# EAGLE schematic Logic level converter (EAGLE 7.6.0)
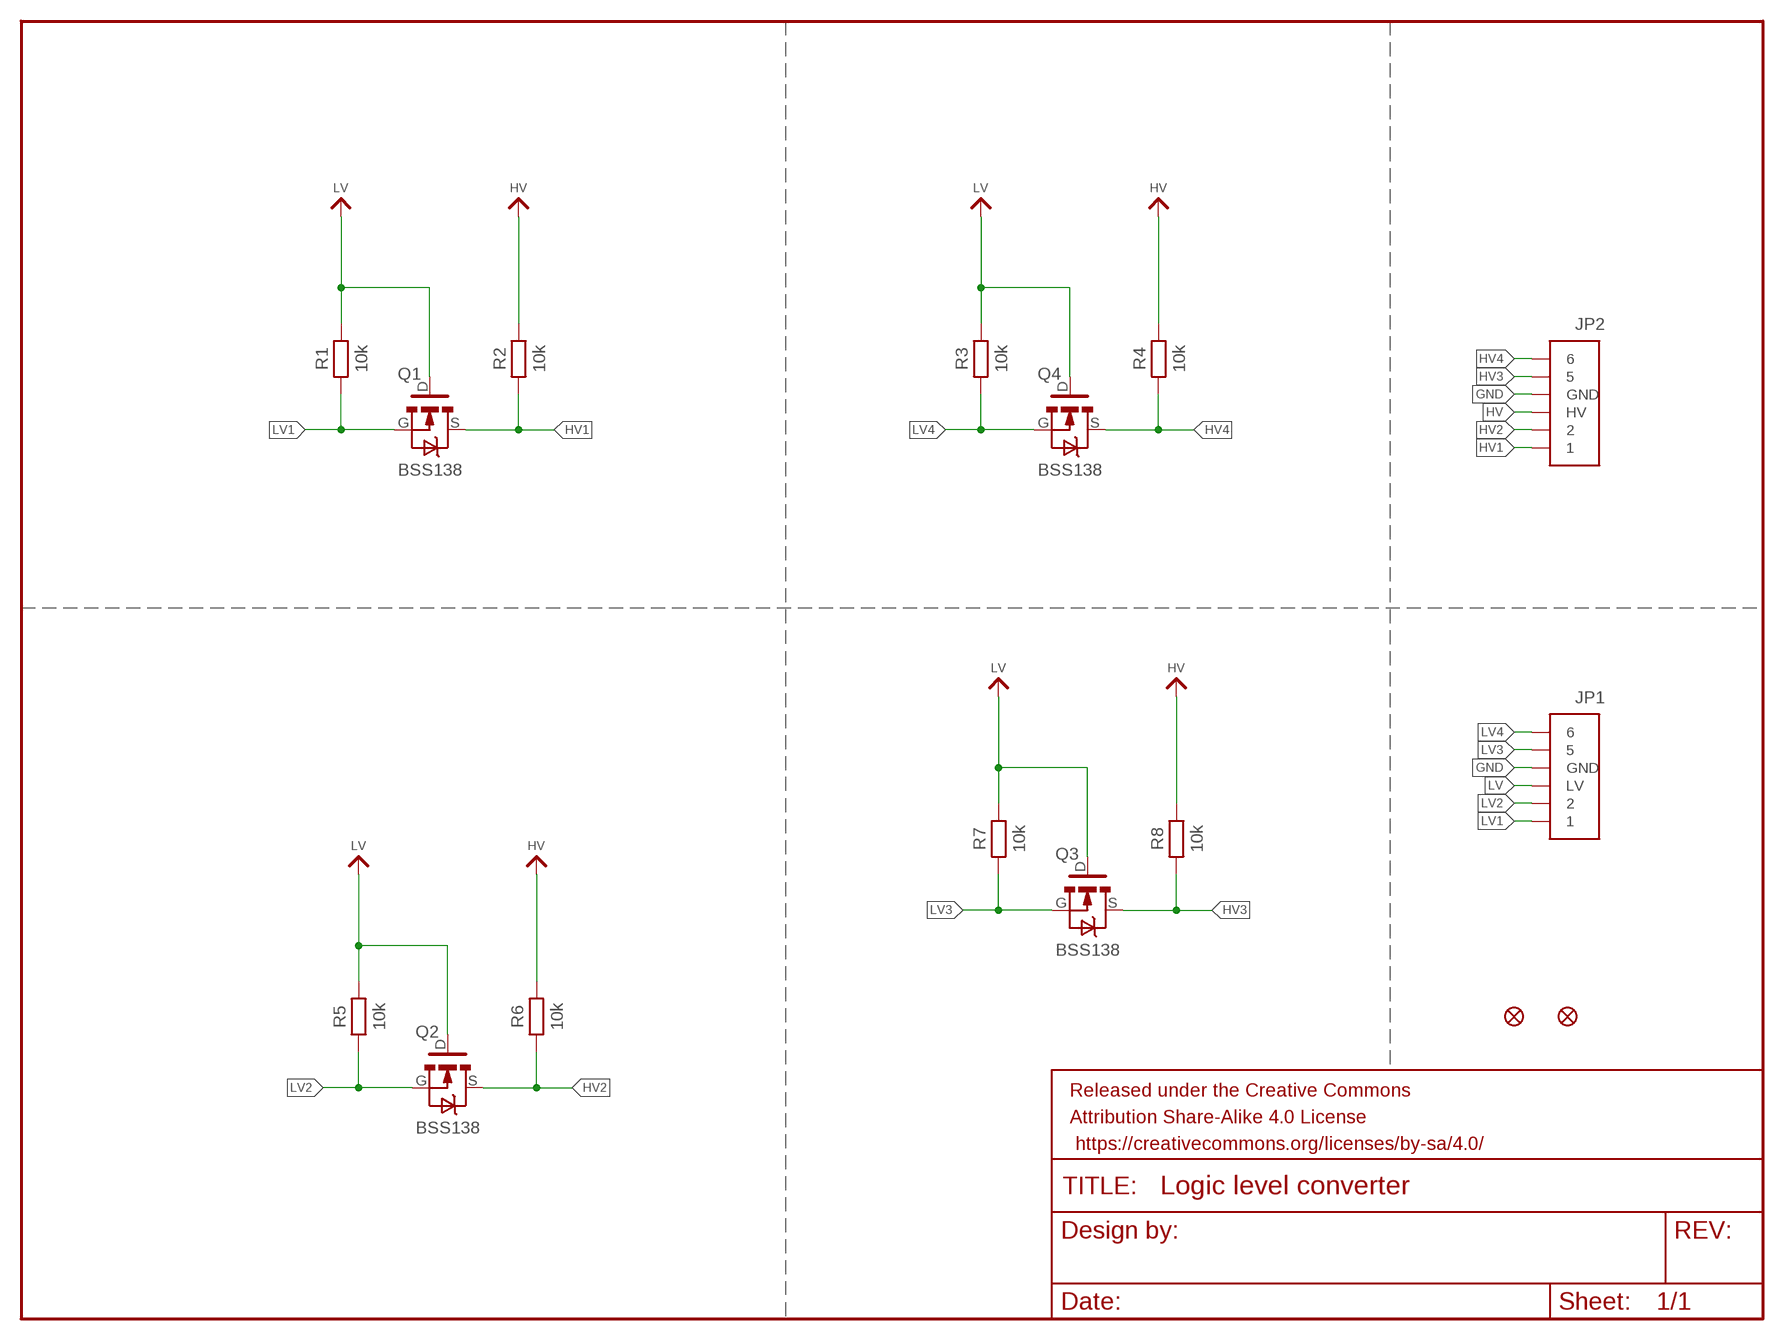
[diagram p0: schematic, sheet 1]

## Parts
FD1  FIDUCIAL1X2  [FIDUCIAL-1X2]
FD2  FIDUCIALUFIDUCIAL  [FIDUCIAL-MICRO]
FRAME1  FRAME-LETTERNO_PACKAGE  [DUMMY]
JP1  JUMPER_6PIN_LLC_LV  [JUMPER_6PIN_LLC_LV]
JP2  JUMPER_6PIN_LLC_HV  [JUMPER_6PIN_LLC_HV]
Q1  BSS138  [SOT-23]
Q2  BSS138  [SOT-23]
Q3  BSS138  [SOT-23]
Q4  BSS138  [SOT-23]
R1  10k  0603_RESISTOR  [0603_RESISTOR]
R2  10k  0603_RESISTOR  [0603_RESISTOR]
R3  10k  0603_RESISTOR  [0603_RESISTOR]
R4  10k  0603_RESISTOR  [0603_RESISTOR]
R5  10k  0603_RESISTOR  [0603_RESISTOR]
R6  10k  0603_RESISTOR  [0603_RESISTOR]
R7  10k  0603_RESISTOR  [0603_RESISTOR]
R8  10k  0603_RESISTOR  [0603_RESISTOR]

## Nets
GND: JP1.GND JP2.GND
HV: JP2.HV R2.P$2 R4.P$2 R6.P$2 R8.P$2
HV1: JP2.1 Q1.S R2.P$1
HV2: JP2.2 Q2.S R6.P$1
HV3: JP2.5 Q3.S R8.P$1
HV4: JP2.6 Q4.S R4.P$1
LV: JP1.LV Q1.D Q2.D Q3.D Q4.D R1.P$2 R3.P$2 R5.P$2 R7.P$2
LV1: JP1.1 Q1.G R1.P$1
LV2: JP1.2 Q2.G R5.P$1
LV3: JP1.5 Q3.G R7.P$1
LV4: JP1.6 Q4.G R3.P$1

## Library data of the parts
FD1 FD2 = SparkFun-Aesthetics:FIDUCIAL: Fiducial Alignment Points Point-of-reference for pick-and-place machines and other optical instruments.
FRAME1 = SparkFun-Aesthetics:FRAME-LETTER: Schematic Frame - Letter Standard 8.5x11 US Letter frame; DESIGNER: Nobody; VERSION: v01
JP1 = Bruno_library2:JUMPER_6PIN_LLC_LV
JP2 = Bruno_library2:JUMPER_6PIN_LLC_HV
Q1-Q4 = Bruno_library2:BSS138
R1-R8 = Bruno_library2:0603_RESISTOR: Resistor in 0603 package